# Altium project Laser-Cueing-LSM9DS1.PrjPcb
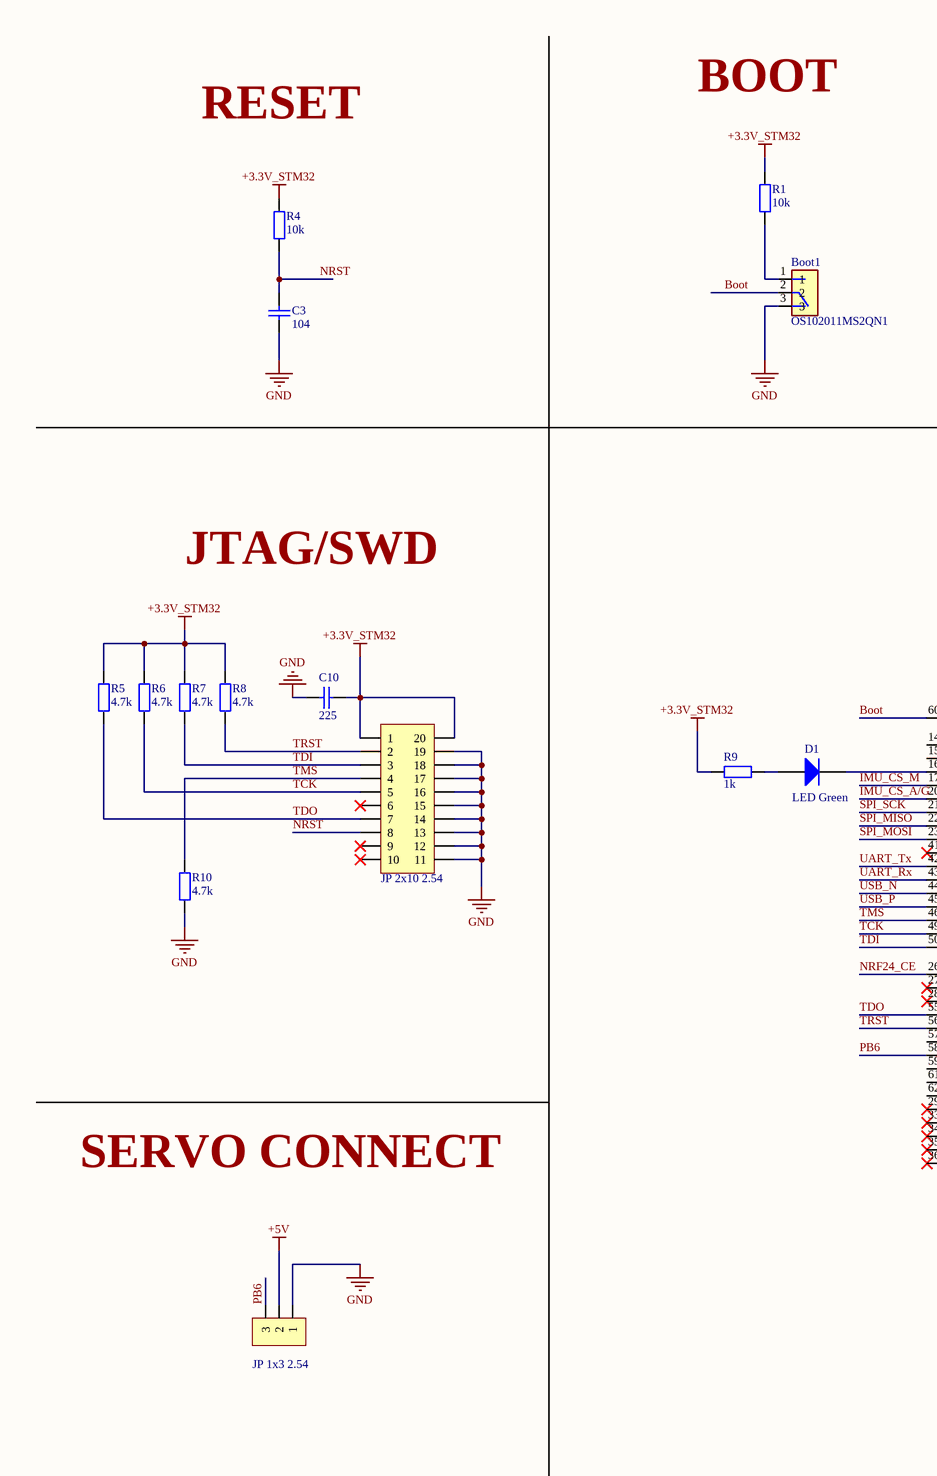
[diagram p0: MCU.SchDoc, left]
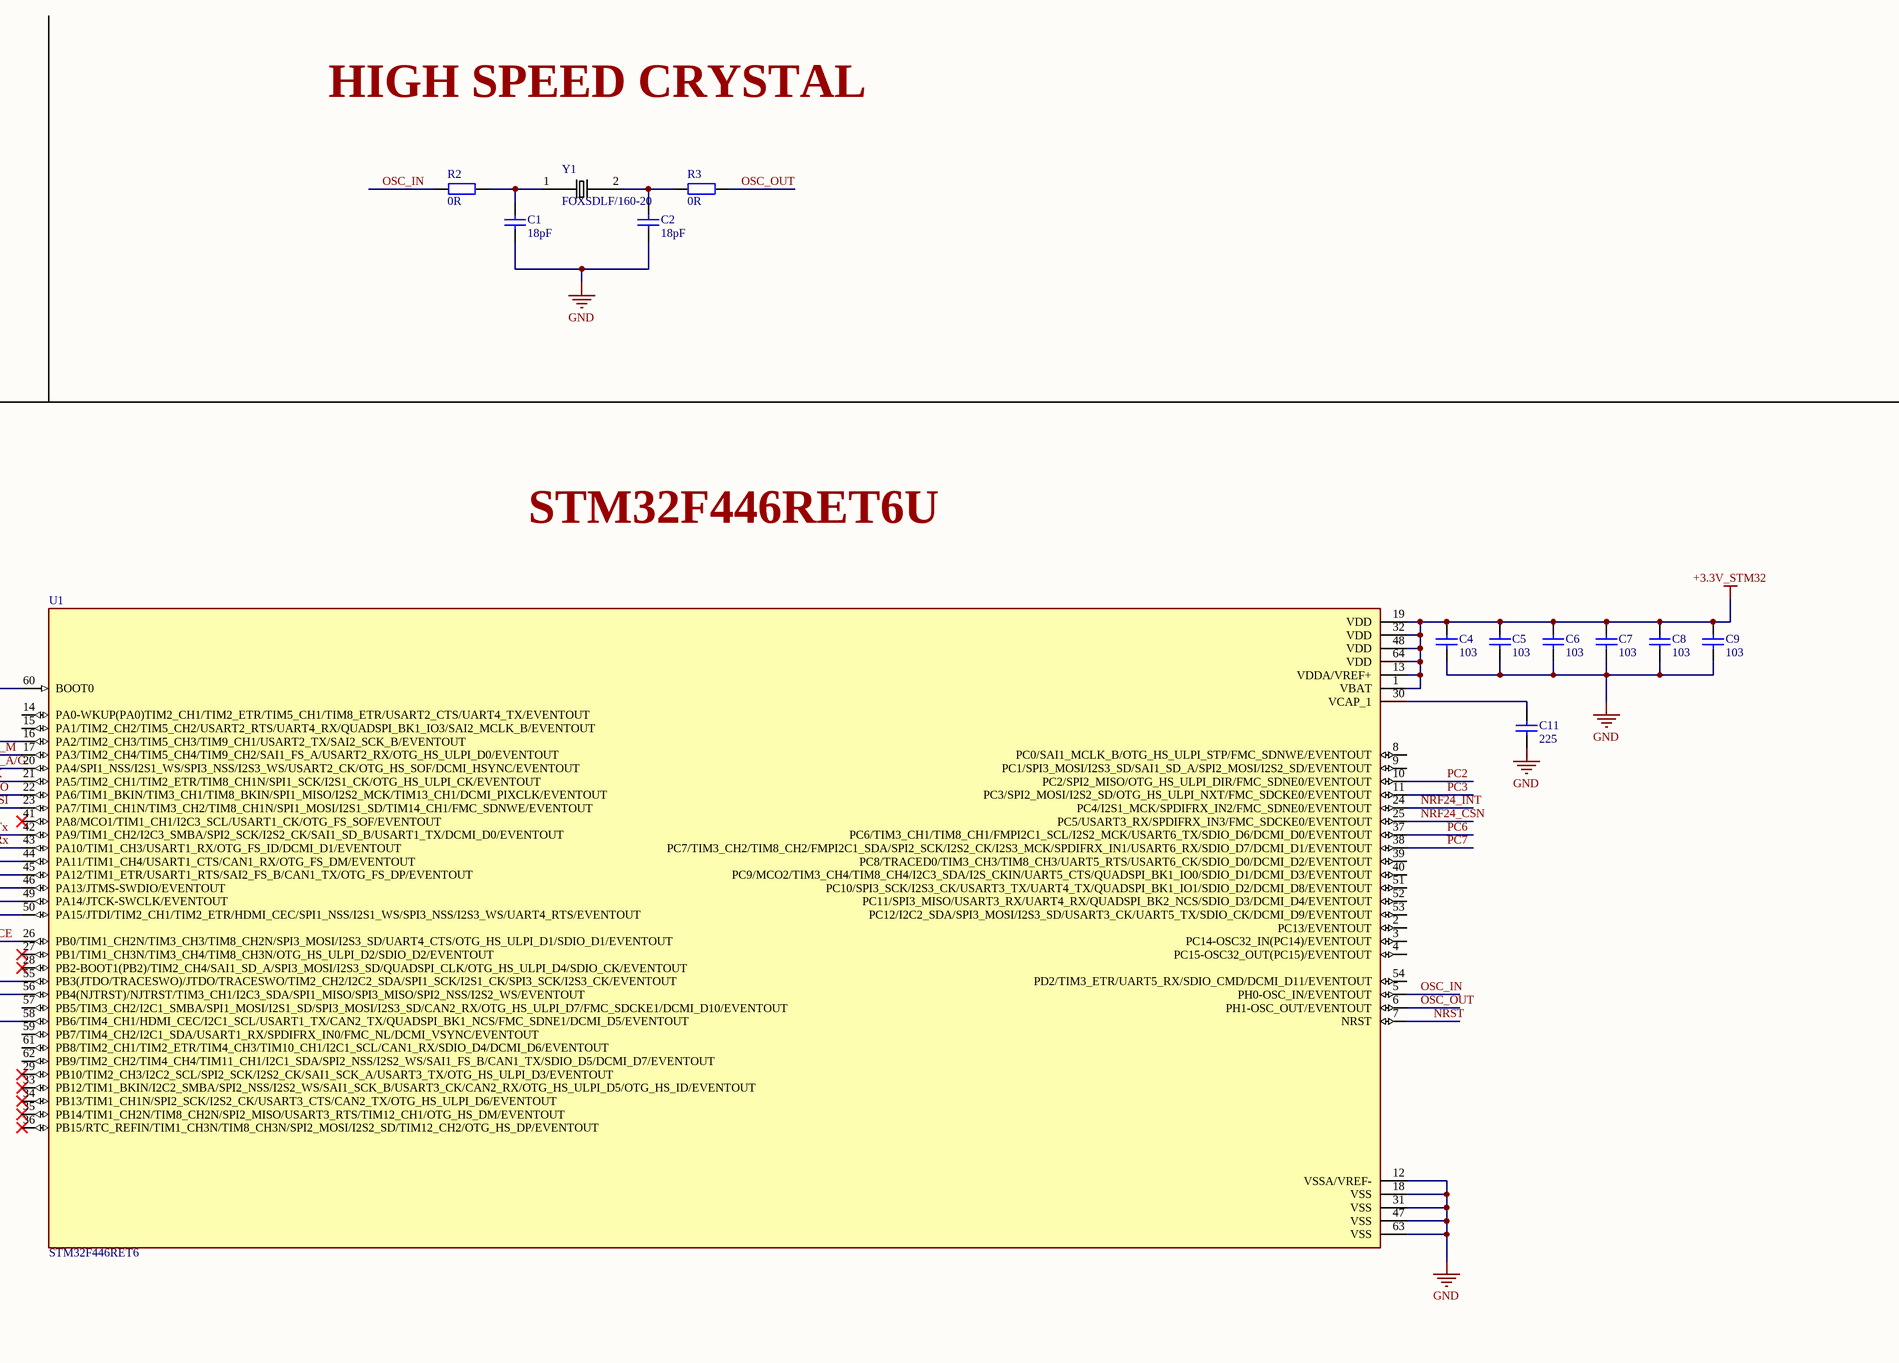
[diagram p1: MCU.SchDoc, right]
5 sheets, 73 parts. Net scope: global (net labels, ports and power ports of the same name join across sheets).
Board file: Cueing-shoes-LSM9DS1.PcbDoc
Sheets:
  MCU.SchDoc
  Peripheral.SchDoc
  Driver.SchDoc
  ADC.SchDoc
  PowerSrc.SchDoc

## Sheet MCU.SchDoc
size A2

### Parts
Boot1  OS102011MS2QN1  [SW_OS102011MS2QN1]
C1  18pF  [tu 0805]
C2  18pF  [tu 0805]
C3  104  [tu 1206]
C4  103  [tu 0603]
C5  103  [tu 0603]
C6  103  [tu 0603]
C7  103  [tu 0603]
C8  103  [tu 0603]
C9  103  [tu 0603]
C10  225  [tu 0805]
C11  225  [tu 0805]
D1  LED Green  [J1-0603]
R1  10k  [tro smd 0603]
R2  0R  [tro smd 0603]
R3  0R  [tro smd 0603]
R4  10k  [tro smd 0603]
R5  4.7k  [tro smd 0603]
R6  4.7k  [tro smd 0603]
R7  4.7k  [tro smd 0603]
R8  4.7k  [tro smd 0603]
R9  1k  [tro smd 0603]
R10  4.7k  [tro smd 0603]
Servo1  JP 1x3 2.54  [JP 1x3 DT]
SWD/JTAG1  JP 2x10 2.54  [JP 2x10 DT]
U1  STM32F446RET6  [QFP50P1200X1200X160-64N]
Y1  FOXSDLF/160-20  [SMD_Crystal]

### Nets
+3.3V_STM32: C4.1 C5.1 C6.1 C7.1 C8.1 C9.1 C10.1 R1.2 R4.2 R5.2 R6.2 R7.2 R8.2 R9.2 SWD/JTAG1.1 SWD/JTAG1.20 U1.1(VBAT) U1.13(VDDA/VREF+) U1.19(VDD) U1.32(VDD) U1.48(VDD) U1.64(VDD)
+5V: Servo1.2
GND: Boot1.3 C1.2 C2.2 C3.2 C4.2 C5.2 C6.2 C7.2 C8.2 C9.2 C10.2 C11.2 R10.1 Servo1.1 SWD/JTAG1.11 SWD/JTAG1.12 SWD/JTAG1.13 SWD/JTAG1.14 SWD/JTAG1.15 SWD/JTAG1.16 SWD/JTAG1.17 SWD/JTAG1.18 SWD/JTAG1.19 U1.12(VSSA/VREF-) U1.18(VSS) U1.31(VSS) U1.47(VSS) U1.63(VSS)
Boot: Boot1.2 U1.60(BOOT0)
IMU_CS_A/G: U1.20(PA4/SPI1_NSS/I2S1_WS/SPI3_NSS/I2S3_WS/USART2_CK/OTG_HS_SOF/DCMI_HSYNC/EVENTOUT)
IMU_CS_M: U1.17(PA3/TIM2_CH4/TIM5_CH4/TIM9_CH2/SAI1_FS_A/USART2_RX/OTG_HS_ULPI_D0/EVENTOUT)
NRF24_CE: U1.26(PB0/TIM1_CH2N/TIM3_CH3/TIM8_CH2N/SPI3_MOSI/I2S3_SD/UART4_CTS/OTG_HS_ULPI_D1/SDIO_D1/EVENTOUT)
NRF24_CSN: U1.25(PC5/USART3_RX/SPDIFRX_IN3/FMC_SDCKE0/EVENTOUT)
NRF24_INT: U1.24(PC4/I2S1_MCK/SPDIFRX_IN2/FMC_SDNE0/EVENTOUT)
NRST: C3.1 R4.1 SWD/JTAG1.8 U1.7(NRST)
OSC_IN: R2.1 U1.5(PH0-OSC_IN/EVENTOUT)
OSC_OUT: R3.2 U1.6(PH1-OSC_OUT/EVENTOUT)
PB6: Servo1.3 U1.58(PB6/TIM4_CH1/HDMI_CEC/I2C1_SCL/USART1_TX/CAN2_TX/QUADSPI_BK1_NCS/FMC_SDNE1/DCMI_D5/EVENTOUT)
PC2: U1.10(PC2/SPI2_MISO/OTG_HS_ULPI_DIR/FMC_SDNE0/EVENTOUT)
PC3: U1.11(PC3/SPI2_MOSI/I2S2_SD/OTG_HS_ULPI_NXT/FMC_SDCKE0/EVENTOUT)
PC6: U1.37(PC6/TIM3_CH1/TIM8_CH1/FMPI2C1_SCL/I2S2_MCK/USART6_TX/SDIO_D6/DCMI_D0/EVENTOUT)
PC7: U1.38(PC7/TIM3_CH2/TIM8_CH2/FMPI2C1_SDA/SPI2_SCK/I2S2_CK/I2S3_MCK/SPDIFRX_IN1/USART6_RX/SDIO_D7/DCMI_D1/EVENTOUT)
SPI_MISO: U1.22(PA6/TIM1_BKIN/TIM3_CH1/TIM8_BKIN/SPI1_MISO/I2S2_MCK/TIM13_CH1/DCMI_PIXCLK/EVENTOUT)
SPI_MOSI: U1.23(PA7/TIM1_CH1N/TIM3_CH2/TIM8_CH1N/SPI1_MOSI/I2S1_SD/TIM14_CH1/FMC_SDNWE/EVENTOUT)
SPI_SCK: U1.21(PA5/TIM2_CH1/TIM2_ETR/TIM8_CH1N/SPI1_SCK/I2S1_CK/OTG_HS_ULPI_CK/EVENTOUT)
TCK: R6.1 SWD/JTAG1.5 U1.49(PA14/JTCK-SWCLK/EVENTOUT)
TDI: R7.1 SWD/JTAG1.3 U1.50(PA15/JTDI/TIM2_CH1/TIM2_ETR/HDMI_CEC/SPI1_NSS/I2S1_WS/SPI3_NSS/I2S3_WS/UART4_RTS/EVENTOUT)
TDO: R5.1 SWD/JTAG1.7 U1.55(PB3(JTDO/TRACESWO)/JTDO/TRACESWO/TIM2_CH2/I2C2_SDA/SPI1_SCK/I2S1_CK/SPI3_SCK/I2S3_CK/EVENTOUT)
TMS: R10.2 SWD/JTAG1.4 U1.46(PA13/JTMS-SWDIO/EVENTOUT)
TRST: R8.1 SWD/JTAG1.2 U1.56(PB4(NJTRST)/NJTRST/TIM3_CH1/I2C3_SDA/SPI1_MISO/SPI3_MISO/SPI2_NSS/I2S2_WS/EVENTOUT)
UART_Rx: U1.43(PA10/TIM1_CH3/USART1_RX/OTG_FS_ID/DCMI_D1/EVENTOUT)
UART_Tx: U1.42(PA9/TIM1_CH2/I2C3_SMBA/SPI2_SCK/I2S2_CK/SAI1_SD_B/USART1_TX/DCMI_D0/EVENTOUT)
USB_N: U1.44(PA11/TIM1_CH4/USART1_CTS/CAN1_RX/OTG_FS_DM/EVENTOUT)
USB_P: U1.45(PA12/TIM1_ETR/USART1_RTS/SAI2_FS_B/CAN1_TX/OTG_FS_DP/EVENTOUT)
NetBoot1_1: Boot1.1 R1.1
NetC1_1: C1.1 R2.2 Y1.1
NetC2_1: C2.1 R3.1 Y1.2
NetC11_1: C11.1 U1.30(VCAP_1)
NetD1_1: D1.1(A) R9.1
NetD1_2: D1.2(K) U1.16(PA2/TIM2_CH3/TIM5_CH3/TIM9_CH1/USART2_TX/SAI2_SCK_B/EVENTOUT)

Not connected (* = marked no-connect by the designer): SWD/JTAG1 6* 9* 10*; U1 2(PC13/EVENTOUT) 3(PC14-OSC32_IN(PC14)/EVENTOUT) 4(PC15-OSC32_OUT(PC15)/EVENTOUT) 8(PC0/SAI1_MCLK_B/OTG_HS_ULPI_STP/FMC_SDNWE/EVENTOUT) 9(PC1/SPI3_MOSI/I2S3_SD/SAI1_SD_A/SPI2_MOSI/I2S2_SD/EVENTOUT) 14(PA0-WKUP(PA0)TIM2_CH1/TIM2_ETR/TIM5_CH1/TIM8_ETR/USART2_CTS/UART4_TX/EVENTOUT) 15(PA1/TIM2_CH2/TIM5_CH2/USART2_RTS/UART4_RX/QUADSPI_BK1_IO3/SAI2_MCLK_B/EVENTOUT) 27(PB1/TIM1_CH3N/TIM3_CH4/TIM8_CH3N/OTG_HS_ULPI_D2/SDIO_D2/EVENTOUT)* 28(PB2-BOOT1(PB2)/TIM2_CH4/SAI1_SD_A/SPI3_MOSI/I2S3_SD/QUADSPI_CLK/OTG_HS_ULPI_D4/SDIO_CK/EVENTOUT)* 29(PB10/TIM2_CH3/I2C2_SCL/SPI2_SCK/I2S2_CK/SAI1_SCK_A/USART3_TX/OTG_HS_ULPI_D3/EVENTOUT)* 33(PB12/TIM1_BKIN/I2C2_SMBA/SPI2_NSS/I2S2_WS/SAI1_SCK_B/USART3_CK/CAN2_RX/OTG_HS_ULPI_D5/OTG_HS_ID/EVENTOUT)* 34(PB13/TIM1_CH1N/SPI2_SCK/I2S2_CK/USART3_CTS/CAN2_TX/OTG_HS_ULPI_D6/EVENTOUT)* 35(PB14/TIM1_CH2N/TIM8_CH2N/SPI2_MISO/USART3_RTS/TIM12_CH1/OTG_HS_DM/EVENTOUT)* 36(PB15/RTC_REFIN/TIM1_CH3N/TIM8_CH3N/SPI2_MOSI/I2S2_SD/TIM12_CH2/OTG_HS_DP/EVENTOUT)* 39(PC8/TRACED0/TIM3_CH3/TIM8_CH3/UART5_RTS/USART6_CK/SDIO_D0/DCMI_D2/EVENTOUT) 40(PC9/MCO2/TIM3_CH4/TIM8_CH4/I2C3_SDA/I2S_CKIN/UART5_CTS/QUADSPI_BK1_IO0/SDIO_D1/DCMI_D3/EVENTOUT) 41(PA8/MCO1/TIM1_CH1/I2C3_SCL/USART1_CK/OTG_FS_SOF/EVENTOUT)* 51(PC10/SPI3_SCK/I2S3_CK/USART3_TX/UART4_TX/QUADSPI_BK1_IO1/SDIO_D2/DCMI_D8/EVENTOUT) 52(PC11/SPI3_MISO/USART3_RX/UART4_RX/QUADSPI_BK2_NCS/SDIO_D3/DCMI_D4/EVENTOUT) 53(PC12/I2C2_SDA/SPI3_MOSI/I2S3_SD/USART3_CK/UART5_TX/SDIO_CK/DCMI_D9/EVENTOUT) 54(PD2/TIM3_ETR/UART5_RX/SDIO_CMD/DCMI_D11/EVENTOUT) 57(PB5/TIM3_CH2/I2C1_SMBA/SPI1_MOSI/I2S1_SD/SPI3_MOSI/I2S3_SD/CAN2_RX/OTG_HS_ULPI_D7/FMC_SDCKE1/DCMI_D10/EVENTOUT) 59(PB7/TIM4_CH2/I2C1_SDA/USART1_RX/SPDIFRX_IN0/FMC_NL/DCMI_VSYNC/EVENTOUT) 61(PB8/TIM2_CH1/TIM2_ETR/TIM4_CH3/TIM10_CH1/I2C1_SCL/CAN1_RX/SDIO_D4/DCMI_D6/EVENTOUT) 62(PB9/TIM2_CH2/TIM4_CH4/TIM11_CH1/I2C1_SDA/SPI2_NSS/I2S2_WS/SAI1_FS_B/CAN1_TX/SDIO_D5/DCMI_D7/EVENTOUT)

### Notes on the sheet
- BOOT
- RESET
- HIGH SPEED CRYSTAL
- JTAG/SWD
- STM32F446RET6U
- SERVO CONNECT
- Title
- Size:
- Date:
- File:
- A2
- Number:
- Time:
- Revision:
- Sheet
- of

### Library data of the parts
Boot1 = OS102011MS2QN1: Switch Slide ON ON SPDT Top Slide 0.1A 12VDC 10000Cycles PC Pins Thru-Hole Bulk; MF: {'manufacturer': u'C&K'}; Package: None; Price: None; Value: *; MP: OS102011MS2QN1; Availability: Unavailable
C1 C2 = Tu 0805 20pF 50V 10%: Dán; Don_Vi: Con; Ten_Linh_Kien: Tụ 0805 20P 10% 50V; So_Chan: 2; Ma_Hang: MH004558; Chung_Loai: Dán; Kieu_Chan: *
C3 = Tu 1206 104 50V 20%: Dán; Don_Vi: Con; So_Chan: 2; Ten_Linh_Kien: Tụ 1206 104-0.1uF 20% 50V; Ma_Hang: MH004544; Chung_Loai: Dán; Kieu_Chan: *
C4-C9 = Tu 0603 103 50V 10%: Dán; Don_Vi: Con; So_Chan: 2; Ten_Linh_Kien: Tụ 0603 103-10nF 10% 50V; Ma_Hang: MH004567; Chung_Loai: Dán; Kieu_Chan: *
C10 C11 = Tu 0805 225 25V 10%: Dán; Don_Vi: Con; So_Chan: 2; Ten_Linh_Kien: Tụ 0805 225-2.2uF 25V 10%; Ma_Hang: MH007483; Chung_Loai: Dán; Kieu_Chan: *
D1 = Diode: Default Diode; Published: 8-Jun-2000; LatestRevisionDate: 17-Jul-2002; LatestRevisionNote: Re-released for DXP Platform.; PackageDocument: Sep-1996; PackageReference: SMC; Publisher: Altium Limited; Code_JEDEC: DO-214-AB
R1 R4 = Tro 0603 1% 10k: Dán; Don_Vi: Con; So_Chan: 2; Ten_Linh_Kien: Trở 0603 1% 10k; Ma_Hang: MH006333; Chung_Loai: Dán; Kieu_Chan: *
R2 R3 = Tro 0603 1% 0R: Dán; Don_Vi: Con; So_Chan: 2; Ten_Linh_Kien: Trở 0603 1% 0R; Ma_Hang: MH005792; Chung_Loai: Dán; Kieu_Chan: *
R5-R8 R10 = Tro 0603 5% 4.7k: Dán; Don_Vi: Con; So_Chan: 2; Ten_Linh_Kien: Trở 0603 5% 4.7k; Ma_Hang: MH006327; Chung_Loai: Dán; Kieu_Chan: *
R9 = Tro 0603 1% 1k: Dán; So_Chan: 2; Don_Vi: Con; Ten_Linh_Kien: Trở 0603 1% 1k; Ma_Hang: MH006334; Chung_Loai: Dán; Kieu_Chan: *
Servo1 = JP 1x3 2.54 Duc Thang: Cắm; Ten_Linh_Kien: Jump Đơn Đực 2.54MM 1x40P Thẳng 11MM; Don_Vi: Con; Ma_Hang: MH000903; Ghi_Chu: *; Kieu_Chan: *; Chung_Loai: Cắm
SWD/JTAG1 = JP 2x10 2.54 Duc Thang: Cắm; Ten_Linh_Kien: Jump Đôi Đực 2.54MM 2x40P Thẳng 11MM; Don_Vi: Con; Ma_Hang: MH002686; Ghi_Chu: *; Kieu_Chan: *; Chung_Loai: Cắm
U1 = STM32F446RET6: MCU 32-Bit STM32 ARM Cortex M4 RISC 512KB Flash 2.5V/3.3V 64-Pin LQFP Tray; MF: {'manufacturer': u'STMicroelectronics'}; Package: None; Price: None; Value: *; MP: STM32F446RET6; Availability: Unavailable
Y1 = Crystal 16MHz 20pF 2-Pin: Crystal 16MHz 20pF 2-Pin HC-49/SD; MF: Fox; Package: HC49/US Fox; Digi-Key_Part_Number: 631-1017-2-ND; Digi-Key_Purchase_URL: https://www.digikey.tw/product-detail/en/fox-electronics/FC4SDCBMF16.0-T1/631-1017-2-ND/1024609?utm_source=snapeda&utm_medium=aggregator&utm_campaign=symbol; SnapEDA_Link: https://www.snapeda.com/parts/FOXSDLF/160-20/Fox%20Electronics/view-part/?ref=snap; MP: FOXSDLF/160-20; Value: *

## Sheet Peripheral.SchDoc
size A4
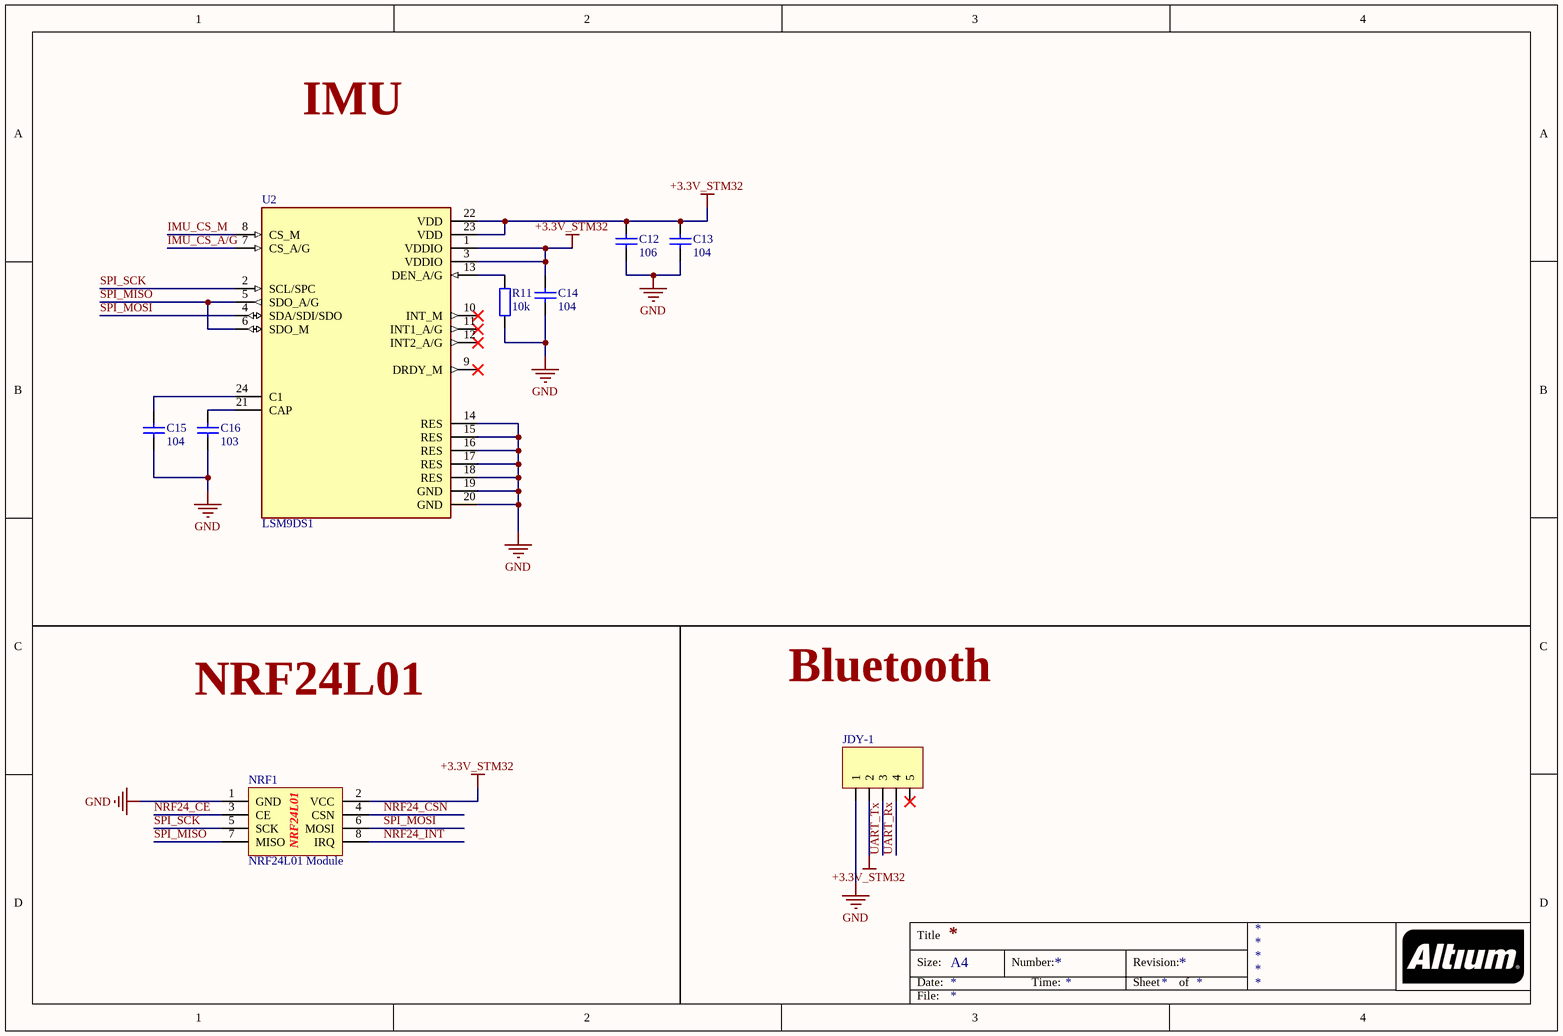
[diagram p2: Peripheral.SchDoc]

### Parts
C12  106  [tu 0603]
C13  104  [tu 0603]
C14  104  [tu 0603]
C15  104  [tu 0603]
C16  103  [tu 0603]
JDY-1  JP 1x5 2.54  [JP 1x5 CC]  (value not drawn)
NRF1  NRF24L01 Module  [NRF24L01]
R11  10k  [tro smd 0603]
U2  LSM9DS1  [PQFN24P43_350X300X102L35X23N]

### Nets
+3.3V_STM32: C12.2 C13.1 C14.1 JDY-1.2 NRF1.2(VCC) U2.1(VDDIO) U2.3(VDDIO) U2.22(VDD) U2.23(VDD)
GND: C12.1 C13.2 C14.2 C15.1 C16.1 JDY-1.1 NRF1.1(GND) R11.1 U2.14(RES) U2.15(RES) U2.16(RES) U2.17(RES) U2.18(RES) U2.19(GND) U2.20(GND)
IMU_CS_A/G: U2.7(CS_A/G)
IMU_CS_M: U2.8(CS_M)
NRF24_CE: NRF1.3(CE)
NRF24_CSN: NRF1.4(CSN)
NRF24_INT: NRF1.8(IRQ)
SPI_MISO: NRF1.7(MISO) U2.5(SDO_A/G) U2.6(SDO_M)
SPI_MOSI: NRF1.6(MOSI) U2.4(SDA/SDI/SDO)
SPI_SCK: NRF1.5(SCK) U2.2(SCL/SPC)
UART_Rx: JDY-1.4
UART_Tx: JDY-1.3
NetC15_2: C15.2 U2.24(C1)
NetC16_2: C16.2 U2.21(CAP)
NetR11_2: R11.2 U2.13(DEN_A/G)

Not connected (* = marked no-connect by the designer): JDY-1 5*; U2 9(DRDY_M)* 10(INT_M)* 11(INT1_A/G)* 12(INT2_A/G)*

### Notes on the sheet
- IMU
- NRF24L01
- Bluetooth
- Title
- Size:
- Date:
- A4
- Number:
- Time:
- Revision:
- Sheet
- of
- File:
- (in symbol NRF24L01 Module) NRF24L01

### Library data of the parts
C12 = Tu 0603 106 16V 20%: Dán; Don_Vi: Con; So_Chan: 2; Ten_Linh_Kien: Tụ 0603-10uF 20% 16V; Ma_Hang: MH004848; Chung_Loai: Dán; Kieu_Chan: *
C13-C15 = Tu 0603 104 50V 10%: Dán; Don_Vi: Con; So_Chan: 2; Ten_Linh_Kien: Tụ 0603 104-100nF 10% 50V; Ma_Hang: MH004568; Chung_Loai: Dán; Kieu_Chan: *
C16 = Tu 0603 103 50V 10%: as C4 on sheet MCU; Chung_Loai: Dán; Kieu_Chan: *
JDY-1 = JP 1x5 2.54 Cai Cong: Cắm; Ten_Linh_Kien: Jump Đơn Cái 2.54MM 1x40P Cong; Don_Vi: Con; Ma_Hang: MH001265; Ghi_Chu: *; Kieu_Chan: *; Chung_Loai: Cắm
R11 = Tro 0603 1% 10k: as R1 on sheet MCU; Chung_Loai: Dán; Kieu_Chan: *
U2 = LSM9DS1: iNEMO inertial module: 3D accelerometer, 3D gyroscope, 3D magnetometer; MF: {'manufacturer': u'STMicroelectronics'}; Package: None; Price: None; Value: *; MP: LSM9DS1; Availability: Unavailable

## Sheet Driver.SchDoc
size A
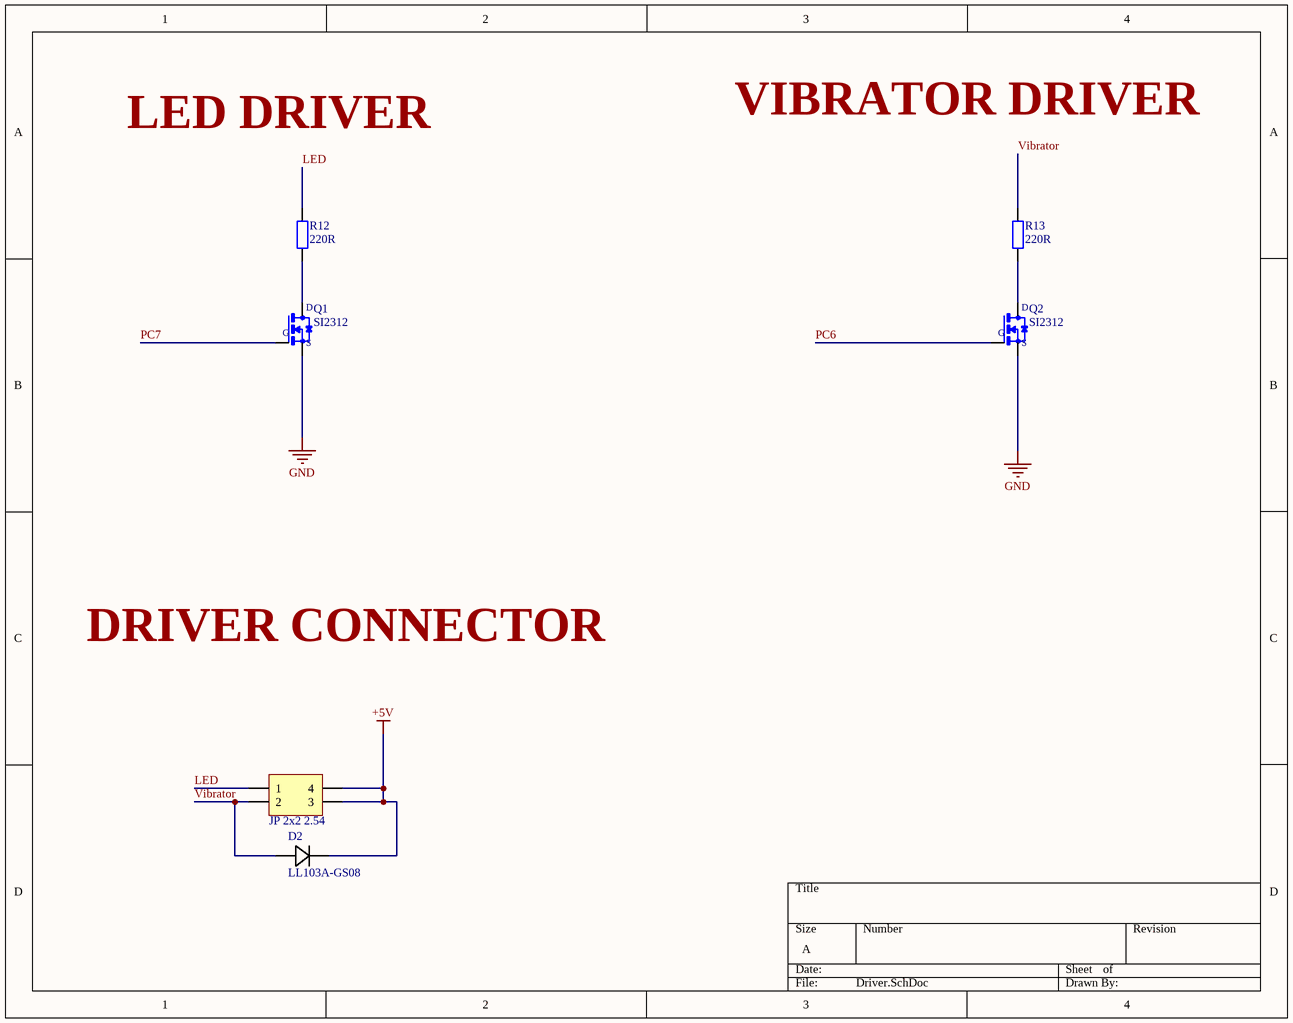
[diagram p3: Driver.SchDoc]

### Parts
D2  LL103A-GS08  [MELF_SOD-80_VIS]
JP1  JP 2x2 2.54  [JP 2x2 DT]
Q1  SI2312  [SOT23]
Q2  SI2312  [SOT23]
R12  220R  [tro smd 0603]
R13  220R  [tro smd 0603]

### Nets
+5V: D2.1 JP1.3 JP1.4
GND: Q1.2(S) Q2.2(S)
LED: JP1.1 R12.2
PC6: Q2.1(G)
PC7: Q1.1(G)
Vibrator: D2.2 JP1.2 R13.2
NetQ1_3: Q1.3(D) R12.1
NetQ2_3: Q2.3(D) R13.1

### Notes on the sheet
- LED DRIVER
- VIBRATOR DRIVER
- DRIVER CONNECTOR

### Library data of the parts
D2 = LL103A-GS08: No Description Available; Mfr_Name: Vishay
JP1 = JP 2x2 2.54 Duc Thang: Cắm; Ten_Linh_Kien: Jump Đôi Đực 2.54MM 2x40P Thẳng 11MM; Don_Vi: Con; Ma_Hang: MH002686; Ghi_Chu: *; Kieu_Chan: *; Chung_Loai: Cắm
Q1 Q2 = SI2312: <b>N-Channel MOSFET</b>    <a href="https://pricing.snapeda.com/parts/SI2312/Micro%20Commercial%20Components/view-part?ref=eda">Check availability</a> <a href="https://pricing.snapeda.com/parts/SI2312/Micro%20Commercial%20Components/view-part?ref=eda">Check availability</a>; MF: {'manufacturer': u'Micro Commercial Components'}; MP: SI2312-TP; Package: None; Price: None; Value: *; Availability: Unavailable
R12 R13 = Tro 0603 5% 220R: Dán; Don_Vi: Con; So_Chan: 2; Ten_Linh_Kien: Trở 0603 5% 220R; Ma_Hang: MH006322; Chung_Loai: Dán; Kieu_Chan: *

## Sheet ADC.SchDoc
size A
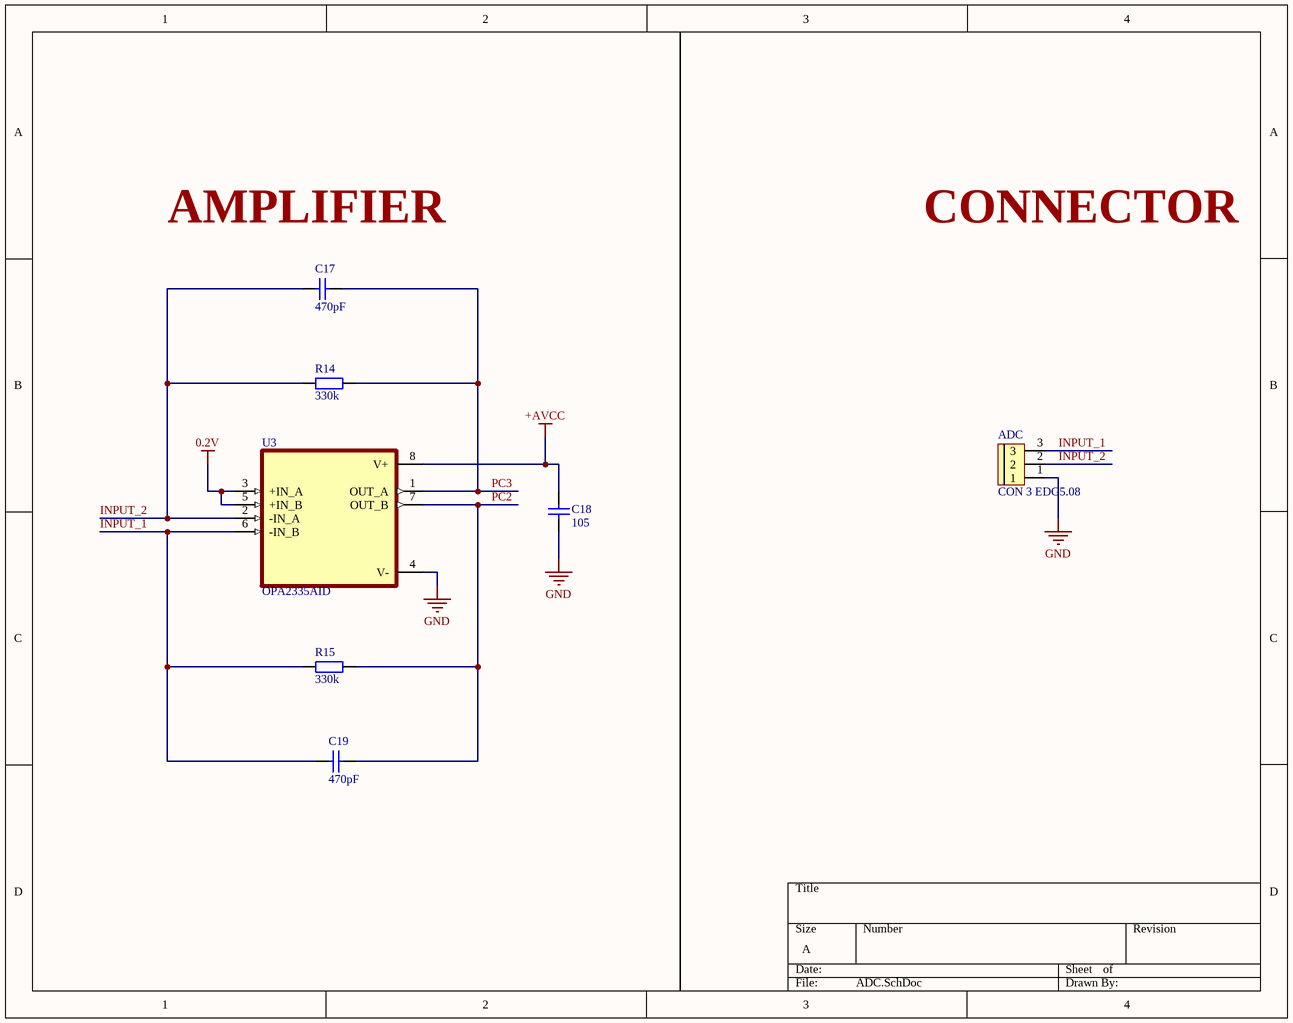
[diagram p4: ADC.SchDoc]

### Parts
ADC  CON 3 EDG5.08  [CON 3 3EDG5.08]
C17  470pF  [tu 0603]
C18  105  [tu 1206]
C19  470pF  [tu 0603]
R14  330k  [Tro SMD 0805]
R15  330k  [Tro SMD 0805]
U3  OPA2335AID  [SOIC127P599X175-8N]

### Nets
0.2V: U3.3(+IN_A) U3.5(+IN_B)
+AVCC: C18.1 U3.8(V+)
GND: ADC.1 C18.2 U3.4(V-)
INPUT_1: ADC.3 C19.2 R15.1 U3.6(-IN_B)
INPUT_2: ADC.2 C17.2 R14.1 U3.2(-IN_A)
PC2: C19.1 R15.2 U3.7(OUT_B)
PC3: C17.1 R14.2 U3.1(OUT_A)

### Notes on the sheet
- AMPLIFIER
- CONNECTOR

### Library data of the parts
ADC = CON 3 EDG5.08: Cắm; Ten_Linh_Kien: CON 3 2EDG5.08-3P 5.08MM ( Xanh Cong); Ma_Hang: MH000760; Ghi_Chu: *; Kieu_Chan: *; Don_Vi: Con; Chung_Loai: Cắm
C17 C19 = Tu 0603 470pF 50V 10%: Dán; Don_Vi: Con; So_Chan: 2; Ten_Linh_Kien: Tụ 0603 470P 50V 10%; Ma_Hang: MH004571; Chung_Loai: Dán; Kieu_Chan: *
C18 = Tu 1206 105 50V 20%: Dán; Don_Vi: Con; So_Chan: 2; Ten_Linh_Kien: Tụ 1206 105-1uF 20% 50V; Ma_Hang: MH004545; Chung_Loai: Dán; Kieu_Chan: *
R14 R15 = Tro 0805 5% 330k: Dán; Don_Vi: Con; So_Chan: 2; Ten_Linh_Kien: Trở 0805 5% 330K; Ma_Hang: MH005336; Chung_Loai: Dán; Kieu_Chan: *
U3 = OPA2335AID: MF: {'manufacturer': u'Texas Instruments'}; Package: None; Price: None; Value: *; MP: OPA2335AID; Availability: Unavailable

## Sheet PowerSrc.SchDoc
size A3
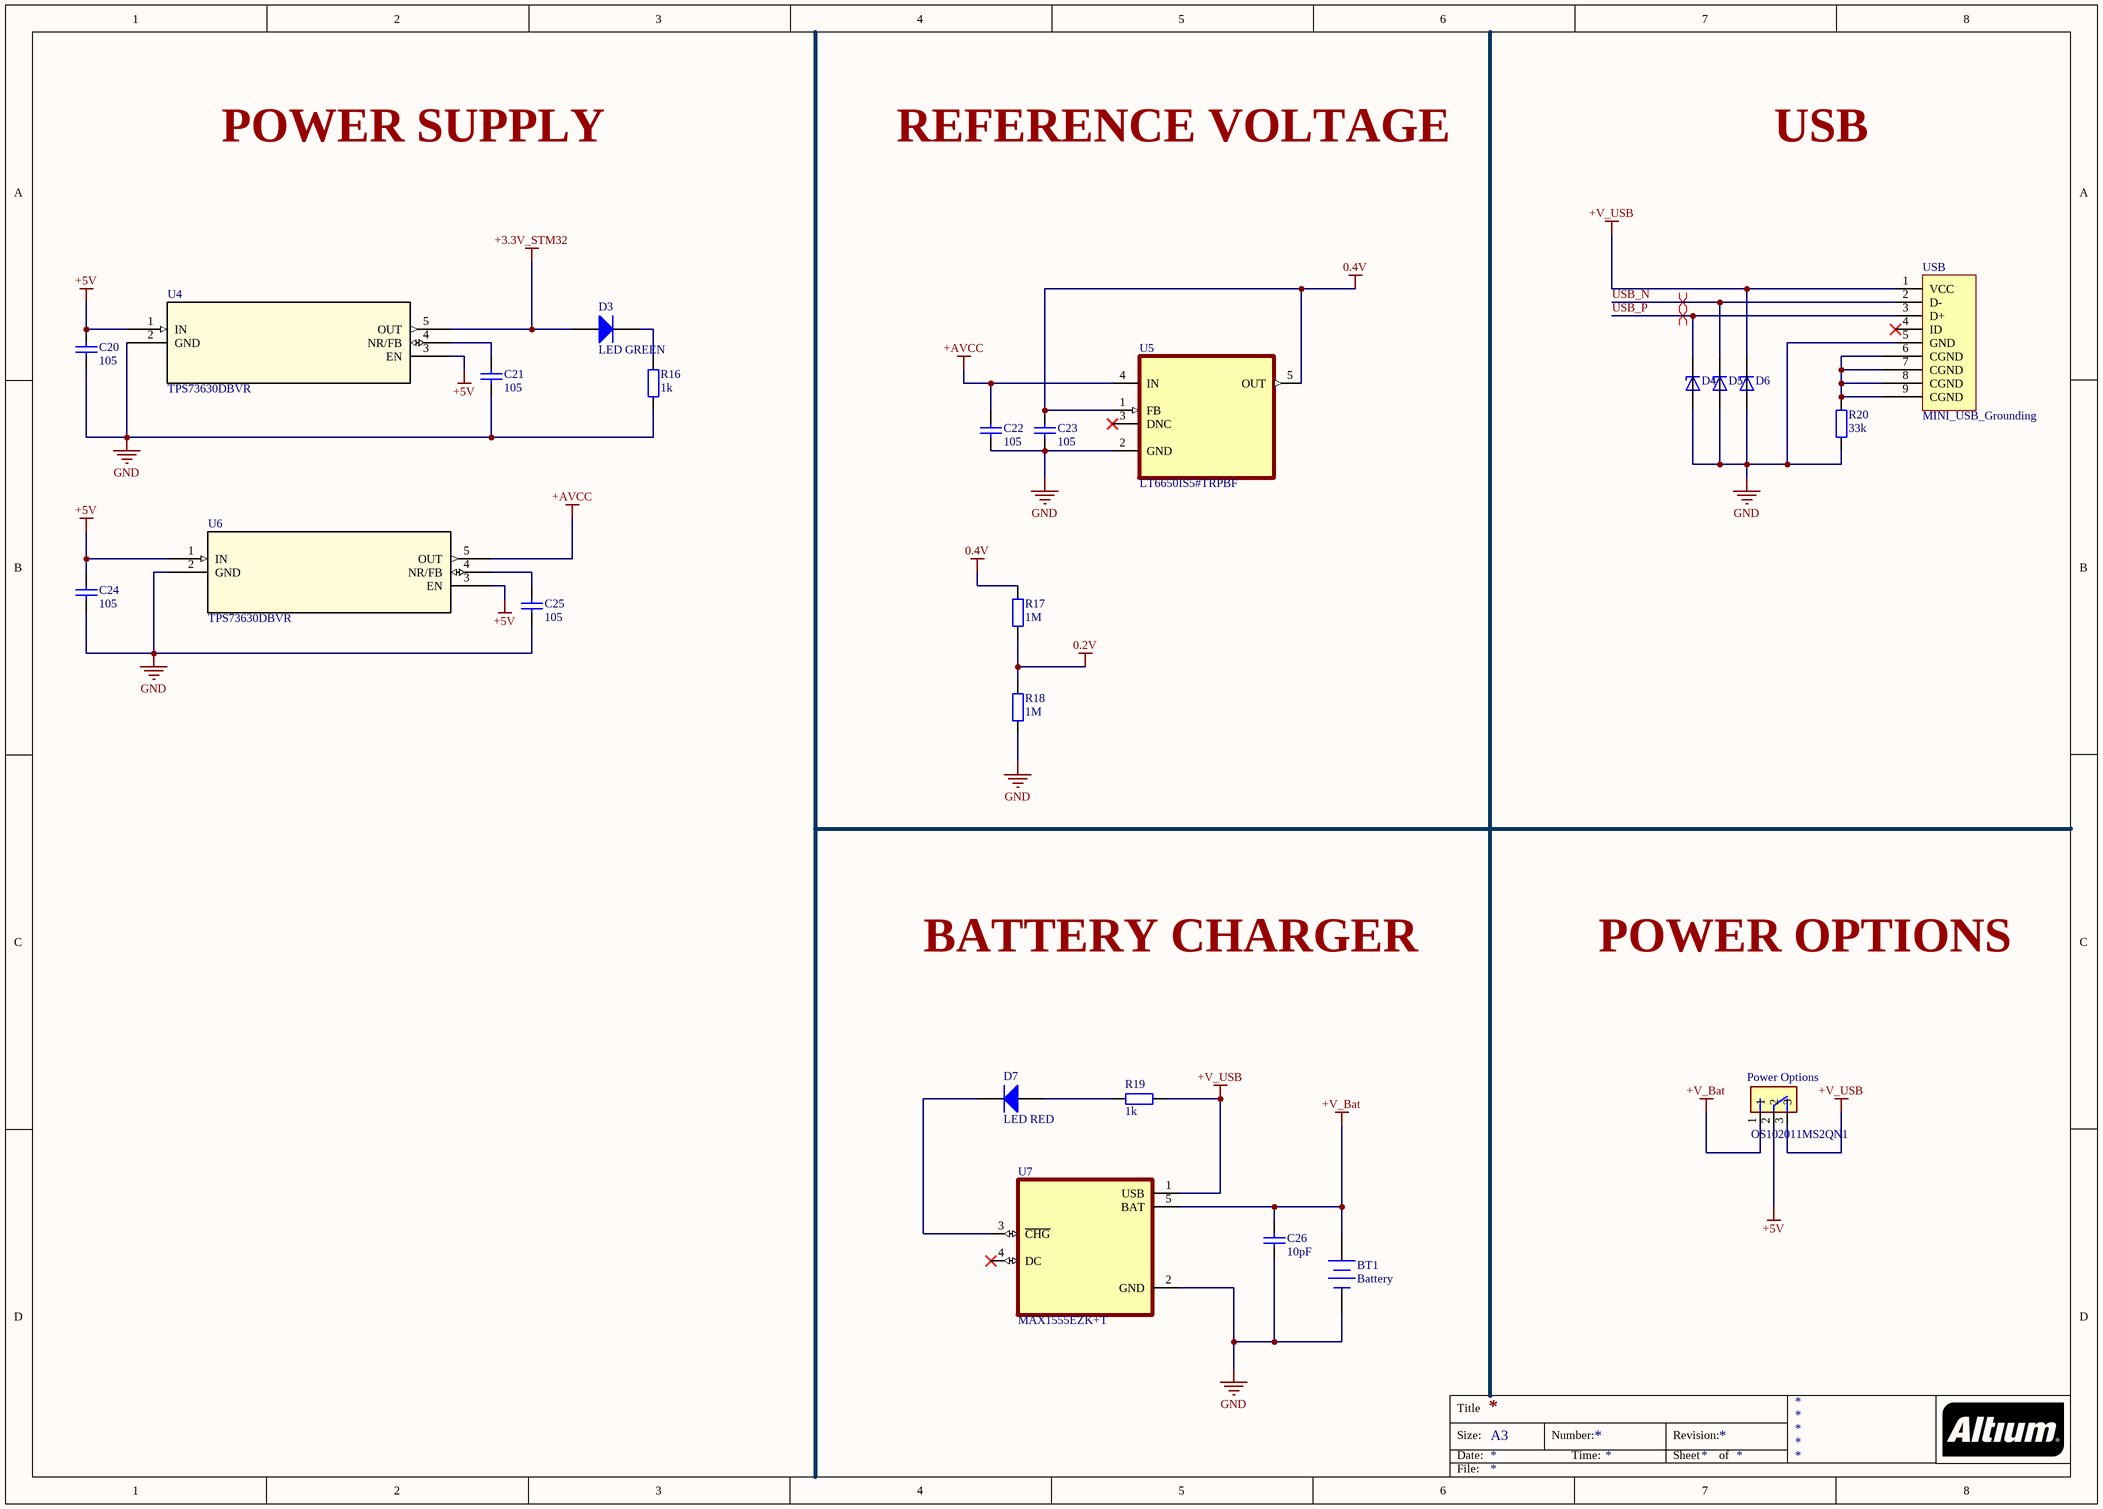
[diagram p5: PowerSrc.SchDoc]

### Parts
BT1  Battery  [BAT-2]
C20  105  [tu 0603]
C21  105  [tu 0603]
C22  105  [tu 0603]
C23  105  [tu 0603]
C24  105  [tu 0603]
C25  105  [tu 0603]
C26  10pF  [tu 0805]
D3  LED GREEN  [J1-0603]
D4  AVRL161A1R1NTA  [TVS_AVRL161A1R1NTA]  (value not drawn)
D5  AVRL161A1R1NTA  [TVS_AVRL161A1R1NTA]  (value not drawn)
D6  AVRL161A1R1NTA  [TVS_AVRL161A1R1NTA]  (value not drawn)
D7  LED RED  [J1-0603]
Power_Options  OS102011MS2QN1  [SW_OS102011MS2QN1]
R16  1k  [tro smd 0603]
R17  1M  [tro smd 0603]
R18  1M  [tro smd 0603]
R19  1k  [tro smd 0603]
R20  33k  [Tro smd 0603]
U4  TPS73630DBVR  [DBV5-M]
U5  LT6650IS5#TRPBF  [SOT95P280X100-5N]
U6  TPS73630DBVR  [DBV5-M]
U7  MAX1555EZK+T  [SOT95P275X110-5N]
USB  MINI_USB_Grounding  [micro_USB shilding]

### Nets
0.2V: R17.1 R18.2
0.4V: C23.1 R17.2 U5.1(FB) U5.5(OUT)
+3.3V_STM32: D3.1(A) U4.5(OUT)
+5V: C20.1 C24.1 Power_Options.2 U4.1(IN) U4.3(EN) U6.1(IN) U6.3(EN)
+AVCC: C22.1 U5.4(IN) U6.5(OUT)
+V_Bat: BT1.1(+) C26.1 Power_Options.1 U7.5(BAT)
+V_USB: D6.1(C) Power_Options.3 R19.2 U7.1(USB) USB.1(VCC)
GND: BT1.2(-) C20.2 C21.2 C22.2 C23.2 C24.2 C25.2 C26.2 D4.2(A) D5.2(A) D6.2(A) R16.2 R18.1 R20.1 U4.2(GND) U5.2(GND) U6.2(GND) U7.2(GND) USB.5(GND)
USB_N: D5.1(C) USB.2(D-)
USB_P: D4.1(C) USB.3(D+)
NetC21_1: C21.1 U4.4(NR/FB)
NetC25_1: C25.1 U6.4(NR/FB)
NetD3_2: D3.2(K) R16.1
NetD7_1: D7.1(A) R19.1
NetD7_2: D7.2(K) U7.3(~{CHG})
NetR20_2: R20.2 USB.6(CGND) USB.7(CGND) USB.8(CGND) USB.9(CGND)

Not connected (* = marked no-connect by the designer): U5 3(DNC)*; U7 4(DC)*; USB 4(ID)*

### Layout directives
differential pair; differential pair class diff90: USB_N, USB_P

### Notes on the sheet
- POWER SUPPLY
- REFERENCE VOLTAGE
- USB
- BATTERY CHARGER
- POWER OPTIONS
- Title
- Size:
- Date:
- A3
- Number:
- Time:
- Revision:
- Sheet
- of
- File:

### Library data of the parts
BT1 = Battery: Multicell Battery; Published: 24-Mar-1999; LatestRevisionDate: 17-Jul-2002; LatestRevisionNote: Re-released for DXP Platform.; PackageReference: BAT-2; Publisher: Altium Limited; PackageDescription: Battery; 2 Leads
C20-C25 = Tu 0603 105 16V 20%: Dán; Don_Vi: Con; So_Chan: 2; Ten_Linh_Kien: Tụ 0603 105-1uF 20% 16V; Ma_Hang: MH004574; Chung_Loai: Dán; Kieu_Chan: *
C26 = Tu 0805 10pF 50V 10%: Dán; Don_Vi: Con; So_Chan: 2; Ten_Linh_Kien: Tụ 0805 10P 10% 50V; Ma_Hang: MH004554; Chung_Loai: Dán; Kieu_Chan: *
D3 D7 = Diode: Default Diode; Published: 8-Jun-2000; LatestRevisionDate: 17-Jul-2002; LatestRevisionNote: Re-released for DXP Platform.; PackageDocument: Sep-1996; PackageReference: SMC; Publisher: Altium Limited; Code_JEDEC: DO-214-AB
D4-D6 = AVRL161A1R1NTA: MF: {'manufacturer': u'TDK'}; Package: None; Price: None; Value: *; MP: AVRL161A1R1NTA; Availability: Unavailable
Power_Options = OS102011MS2QN1: as Boot1 on sheet MCU; Package: None; Price: None; Value: *; MP: OS102011MS2QN1; Availability: Unavailable
R16 = Tro 0603 5% 1k: Dán; Don_Vi: Con; So_Chan: 2; Ten_Linh_Kien: Trở 0603 5% 1k; Ma_Hang: MH006319; Chung_Loai: Dán; Kieu_Chan: *
R17 R18 = Tro 0603 5% 1M: Dán; Don_Vi: Con; So_Chan: 2; Ten_Linh_Kien: Trở 0603 5% 1M; Ma_Hang: MH006909; Chung_Loai: Dán; Kieu_Chan: *
R19 = Tro 0603 1% 1k: as R9 on sheet MCU; Chung_Loai: Dán; Kieu_Chan: *
R20 = Tro 0603 1% 33k: Dán; Don_Vi: Con; So_Chan: 2; Ten_Linh_Kien: Trở 0603 1% 33k; Ma_Hang: MH006335; Chung_Loai: Dán; Kieu_Chan: *
U4 U6 = TPS73630DBVR: No Description Available; Mfr_Name: Texas Instruments; RefDes: RefDes; Type: Type
U5 = LT6650IS5#TRPBF: Micropower, 400mV Reference with Rail-to-Rail Buffer Amplifier; MF: {'manufacturer': u'Analog Devices'}; Package: None; Price: None; Value: *; MP: LT6650IS5#TRPBF; Availability: Unavailable
U7 = MAX1555EZK+T: MF: {'manufacturer': u'Analog Devices'}; Package: None; Price: None; Value: *; MP: MAX1555EZK+T; Availability: Unavailable

## Nets that join several sheets
0.2V: ADC (U3.3 U3.5), PowerSrc (R17.1 R18.2)
+3.3V_STM32: MCU (22 pins), Peripheral (9 pins), PowerSrc (D3.1 U4.5)
+5V: MCU (Servo1.2), Driver (D2.1 JP1.3 JP1.4), PowerSrc (7 pins)
+AVCC: ADC (C18.1 U3.8), PowerSrc (C22.1 U5.4 U6.5)
GND: MCU (28 pins), Peripheral (15 pins), Driver (Q1.2 Q2.2), ADC (ADC.1 C18.2 U3.4), PowerSrc (19 pins)
IMU_CS_A/G: MCU (U1.20), Peripheral (U2.7)
IMU_CS_M: MCU (U1.17), Peripheral (U2.8)
NRF24_CE: MCU (U1.26), Peripheral (NRF1.3)
NRF24_CSN: MCU (U1.25), Peripheral (NRF1.4)
NRF24_INT: MCU (U1.24), Peripheral (NRF1.8)
PC2: MCU (U1.10), ADC (C19.1 R15.2 U3.7)
PC3: MCU (U1.11), ADC (C17.1 R14.2 U3.1)
PC6: MCU (U1.37), Driver (Q2.1)
PC7: MCU (U1.38), Driver (Q1.1)
SPI_MISO: MCU (U1.22), Peripheral (NRF1.7 U2.5 U2.6)
SPI_MOSI: MCU (U1.23), Peripheral (NRF1.6 U2.4)
SPI_SCK: MCU (U1.21), Peripheral (NRF1.5 U2.2)
UART_Rx: MCU (U1.43), Peripheral (JDY-1.4)
UART_Tx: MCU (U1.42), Peripheral (JDY-1.3)
USB_N: MCU (U1.44), PowerSrc (D5.1 USB.2)
USB_P: MCU (U1.45), PowerSrc (D4.1 USB.3)